# Altium schematic sheet TOP.SchDoc
size C; DocumentNumber: 1; SheetNumber: 1; SheetTotal: 13
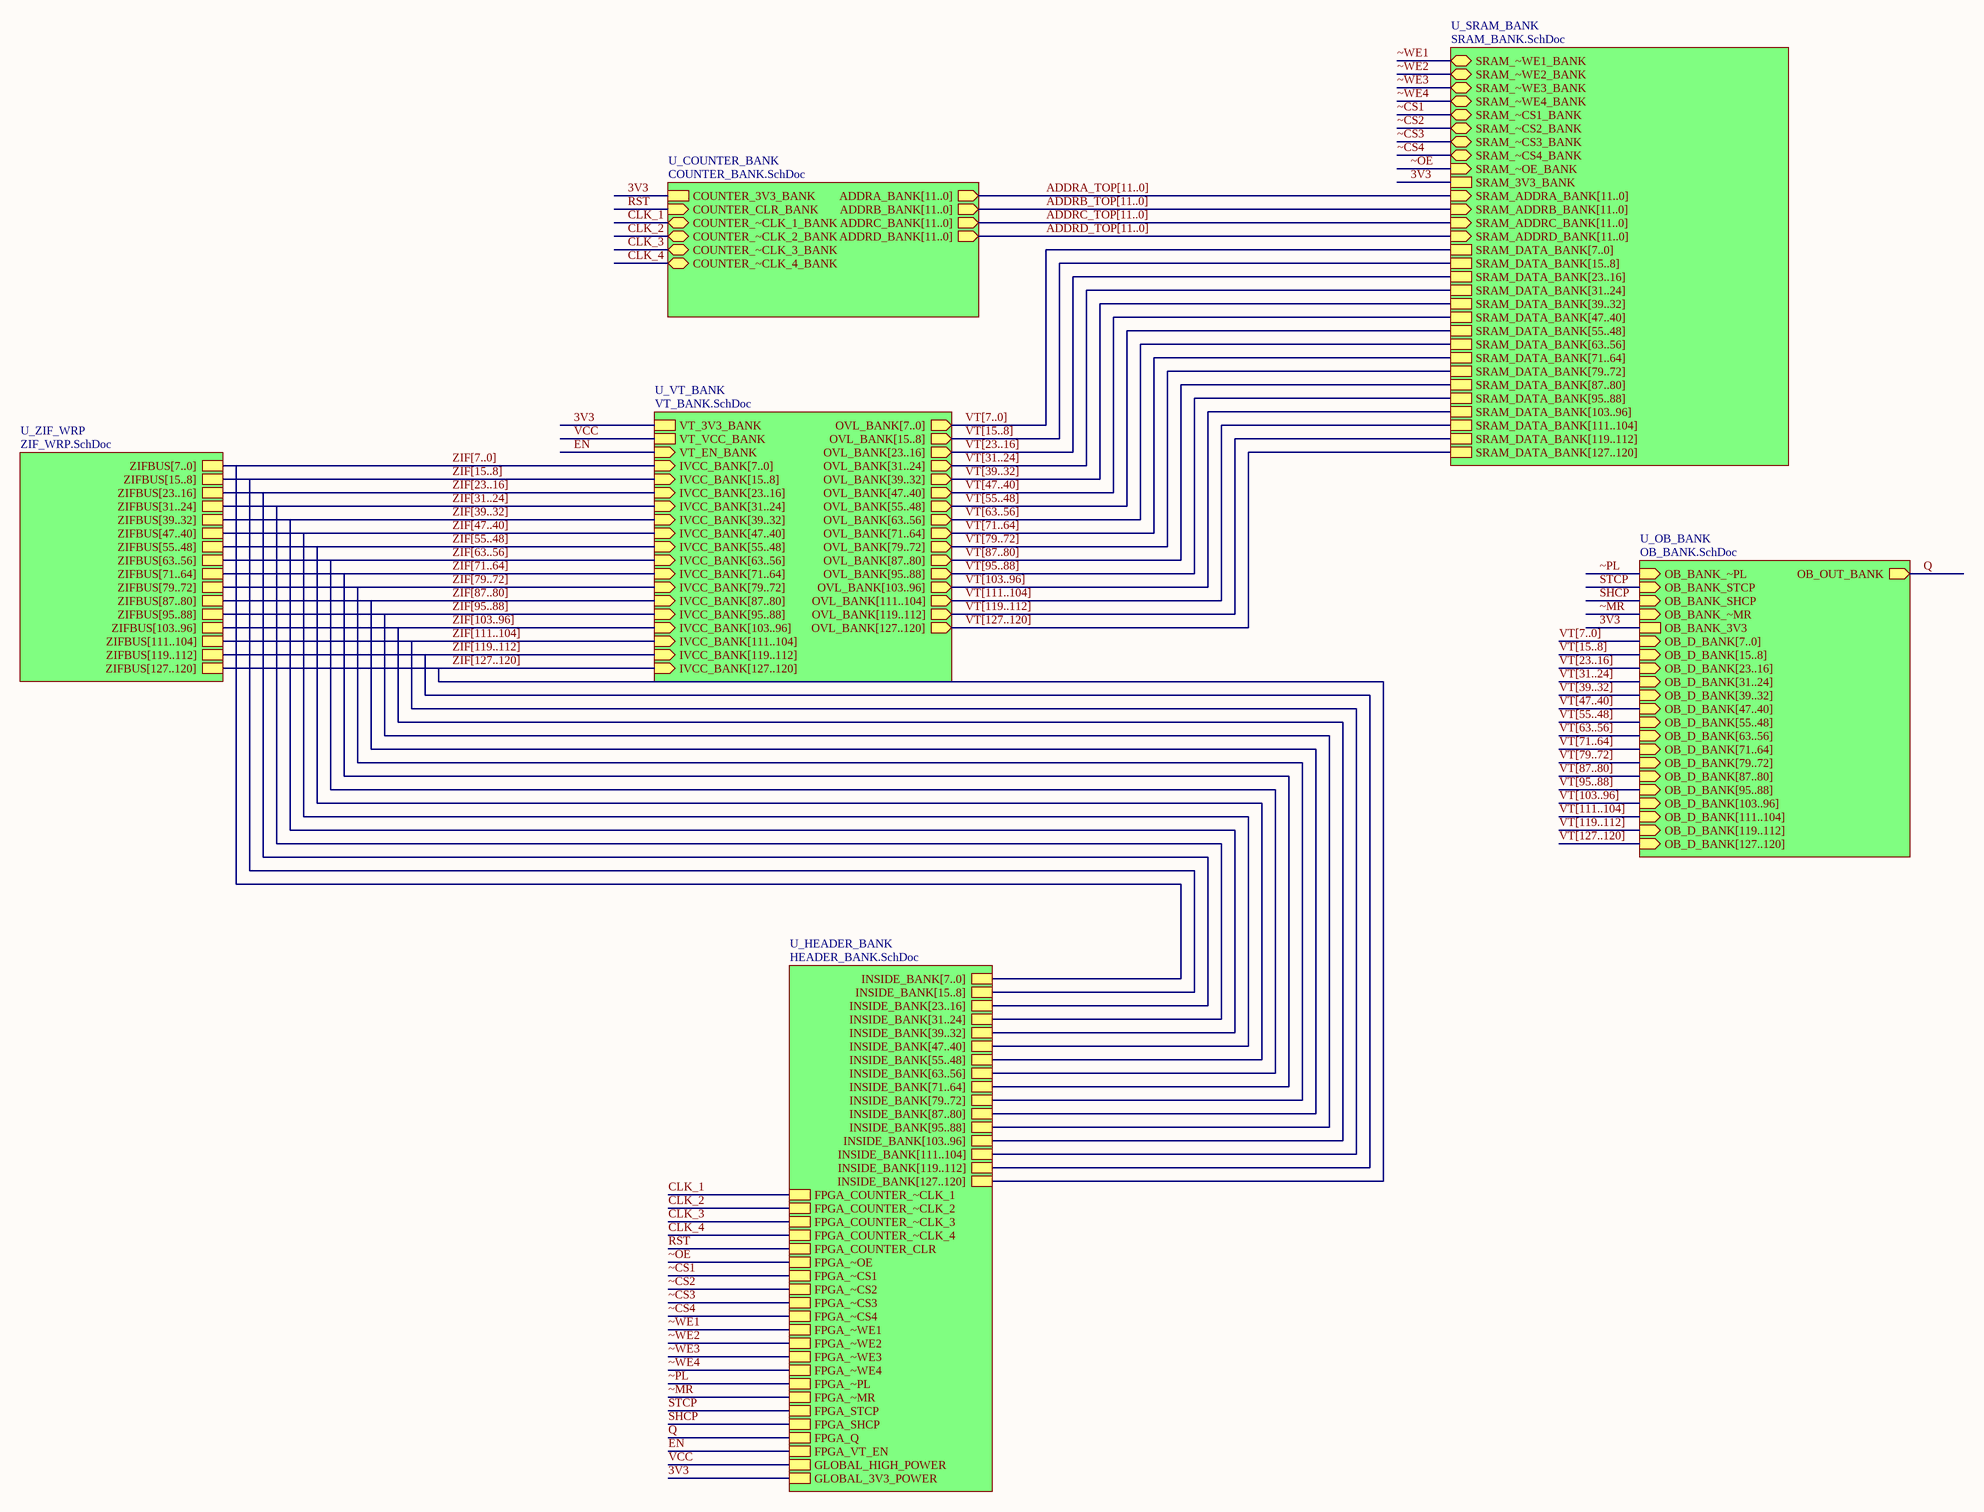
[diagram p0: TOP.SchDoc]

## Sub-sheets
U_COUNTER_BANK = COUNTER_BANK.SchDoc: ADDRA_BANK[11..0], ADDRB_BANK[11..0], ADDRC_BANK[11..0], ADDRD_BANK[11..0], COUNTER_3V3_BANK, COUNTER_CLR_BANK, COUNTER_~CLK_3_BANK, COUNTER_~CLK_2_BANK, COUNTER_~CLK_1_BANK, COUNTER_~CLK_4_BANK
U_HEADER_BANK = HEADER_BANK.SchDoc: INSIDE_BANK[7..0], INSIDE_BANK[15..8], INSIDE_BANK[23..16], INSIDE_BANK[31..24], INSIDE_BANK[39..32], INSIDE_BANK[47..40], INSIDE_BANK[55..48], INSIDE_BANK[63..56], INSIDE_BANK[71..64], INSIDE_BANK[79..72], INSIDE_BANK[87..80], INSIDE_BANK[95..88], INSIDE_BANK[103..96], INSIDE_BANK[111..104], INSIDE_BANK[119..112], INSIDE_BANK[127..120], FPGA_COUNTER_~CLK_2, FPGA_COUNTER_~CLK_3, FPGA_COUNTER_~CLK_4, FPGA_~CS1, FPGA_~OE, FPGA_~WE1, FPGA_~PL, FPGA_~MR, FPGA_STCP, FPGA_SHCP, FPGA_VT_EN, GLOBAL_HIGH_POWER, GLOBAL_3V3_POWER, FPGA_Q, FPGA_~CS2, FPGA_~WE2, FPGA_~CS3, FPGA_~WE3, FPGA_~CS4, FPGA_~WE4, FPGA_COUNTER_~CLK_1, FPGA_COUNTER_CLR
U_OB_BANK = OB_BANK.SchDoc: OB_OUT_BANK, OB_BANK_~PL, OB_BANK_STCP, OB_BANK_SHCP, OB_BANK_~MR, OB_BANK_3V3, OB_D_BANK[7..0], OB_D_BANK[15..8], OB_D_BANK[23..16], OB_D_BANK[31..24], OB_D_BANK[39..32], OB_D_BANK[47..40], OB_D_BANK[55..48], OB_D_BANK[63..56], OB_D_BANK[71..64], OB_D_BANK[79..72], OB_D_BANK[87..80], OB_D_BANK[95..88], OB_D_BANK[103..96], OB_D_BANK[111..104], OB_D_BANK[119..112], OB_D_BANK[127..120]
U_SRAM_BANK = SRAM_BANK.SchDoc: SRAM_~OE_BANK, SRAM_3V3_BANK, SRAM_ADDRA_BANK[11..0], SRAM_ADDRB_BANK[11..0], SRAM_ADDRC_BANK[11..0], SRAM_ADDRD_BANK[11..0], SRAM_DATA_BANK[7..0], SRAM_DATA_BANK[23..16], SRAM_DATA_BANK[39..32], SRAM_DATA_BANK[55..48], SRAM_DATA_BANK[71..64], SRAM_DATA_BANK[87..80], SRAM_DATA_BANK[103..96], SRAM_DATA_BANK[119..112], SRAM_DATA_BANK[15..8], SRAM_DATA_BANK[31..24], SRAM_DATA_BANK[47..40], SRAM_DATA_BANK[63..56], SRAM_DATA_BANK[79..72], SRAM_DATA_BANK[95..88], SRAM_DATA_BANK[111..104], SRAM_DATA_BANK[127..120], SRAM_~CS3_BANK, SRAM_~WE2_BANK, SRAM_~WE3_BANK, SRAM_~WE1_BANK, SRAM_~WE4_BANK, SRAM_~CS4_BANK, SRAM_~CS1_BANK, SRAM_~CS2_BANK
U_VT_BANK = VT_BANK.SchDoc: VT_3V3_BANK, VT_VCC_BANK, VT_EN_BANK, OVL_BANK[7..0], OVL_BANK[15..8], OVL_BANK[23..16], OVL_BANK[31..24], OVL_BANK[39..32], OVL_BANK[47..40], OVL_BANK[55..48], OVL_BANK[63..56], OVL_BANK[71..64], OVL_BANK[79..72], OVL_BANK[87..80], OVL_BANK[95..88], OVL_BANK[103..96], OVL_BANK[111..104], OVL_BANK[119..112], OVL_BANK[127..120], IVCC_BANK[7..0], IVCC_BANK[15..8], IVCC_BANK[23..16], IVCC_BANK[31..24], IVCC_BANK[39..32], IVCC_BANK[47..40], IVCC_BANK[55..48], IVCC_BANK[63..56], IVCC_BANK[71..64], IVCC_BANK[79..72], IVCC_BANK[87..80], IVCC_BANK[95..88], IVCC_BANK[103..96], IVCC_BANK[111..104], IVCC_BANK[119..112], IVCC_BANK[127..120]
U_ZIF_WRP = ZIF_WRP.SchDoc: ZIFBUS[7..0], ZIFBUS[15..8], ZIFBUS[23..16], ZIFBUS[31..24], ZIFBUS[71..64], ZIFBUS[79..72], ZIFBUS[87..80], ZIFBUS[95..88], ZIFBUS[103..96], ZIFBUS[111..104], ZIFBUS[119..112], ZIFBUS[127..120], ZIFBUS[39..32], ZIFBUS[47..40], ZIFBUS[55..48], ZIFBUS[63..56]

## Nets
3V3: sheet U_COUNTER_BANK/COUNTER_3V3_BANK, sheet U_VT_BANK/VT_3V3_BANK, sheet U_OB_BANK/OB_BANK_3V3, sheet U_SRAM_BANK/SRAM_3V3_BANK, sheet U_HEADER_BANK/GLOBAL_3V3_POWER
CLK_1: sheet U_COUNTER_BANK/COUNTER_~CLK_1_BANK, sheet U_HEADER_BANK/FPGA_COUNTER_~CLK_1
CLK_2: sheet U_COUNTER_BANK/COUNTER_~CLK_2_BANK, sheet U_HEADER_BANK/FPGA_COUNTER_~CLK_2
CLK_3: sheet U_COUNTER_BANK/COUNTER_~CLK_3_BANK, sheet U_HEADER_BANK/FPGA_COUNTER_~CLK_3
CLK_4: sheet U_COUNTER_BANK/COUNTER_~CLK_4_BANK, sheet U_HEADER_BANK/FPGA_COUNTER_~CLK_4
EN: sheet U_VT_BANK/VT_EN_BANK, sheet U_HEADER_BANK/FPGA_VT_EN
Q: sheet U_OB_BANK/OB_OUT_BANK, sheet U_HEADER_BANK/FPGA_Q
RST: sheet U_COUNTER_BANK/COUNTER_CLR_BANK, sheet U_HEADER_BANK/FPGA_COUNTER_CLR
SHCP: sheet U_OB_BANK/OB_BANK_SHCP, sheet U_HEADER_BANK/FPGA_SHCP
STCP: sheet U_OB_BANK/OB_BANK_STCP, sheet U_HEADER_BANK/FPGA_STCP
VCC: sheet U_VT_BANK/VT_VCC_BANK, sheet U_HEADER_BANK/GLOBAL_HIGH_POWER
~CS1: sheet U_SRAM_BANK/SRAM_~CS1_BANK, sheet U_HEADER_BANK/FPGA_~CS1
~CS2: sheet U_SRAM_BANK/SRAM_~CS2_BANK, sheet U_HEADER_BANK/FPGA_~CS2
~CS3: sheet U_SRAM_BANK/SRAM_~CS3_BANK, sheet U_HEADER_BANK/FPGA_~CS3
~CS4: sheet U_SRAM_BANK/SRAM_~CS4_BANK, sheet U_HEADER_BANK/FPGA_~CS4
~MR: sheet U_OB_BANK/OB_BANK_~MR, sheet U_HEADER_BANK/FPGA_~MR
~OE: sheet U_SRAM_BANK/SRAM_~OE_BANK, sheet U_HEADER_BANK/FPGA_~OE
~PL: sheet U_OB_BANK/OB_BANK_~PL, sheet U_HEADER_BANK/FPGA_~PL
~WE1: sheet U_SRAM_BANK/SRAM_~WE1_BANK, sheet U_HEADER_BANK/FPGA_~WE1
~WE2: sheet U_SRAM_BANK/SRAM_~WE2_BANK, sheet U_HEADER_BANK/FPGA_~WE2
~WE3: sheet U_SRAM_BANK/SRAM_~WE3_BANK, sheet U_HEADER_BANK/FPGA_~WE3
~WE4: sheet U_SRAM_BANK/SRAM_~WE4_BANK, sheet U_HEADER_BANK/FPGA_~WE4

## Buses and harness runs
bus ADDRA_TOP[11..0] = sheet U_COUNTER_BANK/ADDRA_BANK[11..0] = sheet U_SRAM_BANK/SRAM_ADDRA_BANK[11..0]
bus ADDRB_TOP[11..0] = sheet U_COUNTER_BANK/ADDRB_BANK[11..0] = sheet U_SRAM_BANK/SRAM_ADDRB_BANK[11..0]
bus ADDRC_TOP[11..0] = sheet U_COUNTER_BANK/ADDRC_BANK[11..0] = sheet U_SRAM_BANK/SRAM_ADDRC_BANK[11..0]
bus ADDRD_TOP[11..0] = sheet U_COUNTER_BANK/ADDRD_BANK[11..0] = sheet U_SRAM_BANK/SRAM_ADDRD_BANK[11..0]
bus VT[7..0] = sheet U_OB_BANK/OB_D_BANK[7..0]
bus VT[7..0] = sheet U_SRAM_BANK/SRAM_DATA_BANK[7..0] = sheet U_VT_BANK/OVL_BANK[7..0]
bus VT[15..8] = sheet U_OB_BANK/OB_D_BANK[15..8]
bus VT[15..8] = sheet U_SRAM_BANK/SRAM_DATA_BANK[15..8] = sheet U_VT_BANK/OVL_BANK[15..8]
bus VT[23..16] = sheet U_OB_BANK/OB_D_BANK[23..16]
bus VT[23..16] = sheet U_SRAM_BANK/SRAM_DATA_BANK[23..16] = sheet U_VT_BANK/OVL_BANK[23..16]
bus VT[31..24] = sheet U_OB_BANK/OB_D_BANK[31..24]
bus VT[31..24] = sheet U_SRAM_BANK/SRAM_DATA_BANK[31..24] = sheet U_VT_BANK/OVL_BANK[31..24]
bus VT[39..32] = sheet U_OB_BANK/OB_D_BANK[39..32]
bus VT[39..32] = sheet U_SRAM_BANK/SRAM_DATA_BANK[39..32] = sheet U_VT_BANK/OVL_BANK[39..32]
bus VT[47..40] = sheet U_OB_BANK/OB_D_BANK[47..40]
bus VT[47..40] = sheet U_SRAM_BANK/SRAM_DATA_BANK[47..40] = sheet U_VT_BANK/OVL_BANK[47..40]
bus VT[55..48] = sheet U_OB_BANK/OB_D_BANK[55..48]
bus VT[55..48] = sheet U_SRAM_BANK/SRAM_DATA_BANK[55..48] = sheet U_VT_BANK/OVL_BANK[55..48]
bus VT[63..56] = sheet U_OB_BANK/OB_D_BANK[63..56]
bus VT[63..56] = sheet U_SRAM_BANK/SRAM_DATA_BANK[63..56] = sheet U_VT_BANK/OVL_BANK[63..56]
bus VT[71..64] = sheet U_OB_BANK/OB_D_BANK[71..64]
bus VT[71..64] = sheet U_SRAM_BANK/SRAM_DATA_BANK[71..64] = sheet U_VT_BANK/OVL_BANK[71..64]
bus VT[79..72] = sheet U_OB_BANK/OB_D_BANK[79..72]
bus VT[79..72] = sheet U_SRAM_BANK/SRAM_DATA_BANK[79..72] = sheet U_VT_BANK/OVL_BANK[79..72]
bus VT[87..80] = sheet U_OB_BANK/OB_D_BANK[87..80]
bus VT[87..80] = sheet U_SRAM_BANK/SRAM_DATA_BANK[87..80] = sheet U_VT_BANK/OVL_BANK[87..80]
bus VT[95..88] = sheet U_OB_BANK/OB_D_BANK[95..88]
bus VT[95..88] = sheet U_SRAM_BANK/SRAM_DATA_BANK[95..88] = sheet U_VT_BANK/OVL_BANK[95..88]
bus VT[103..96] = sheet U_OB_BANK/OB_D_BANK[103..96]
bus VT[103..96] = sheet U_SRAM_BANK/SRAM_DATA_BANK[103..96] = sheet U_VT_BANK/OVL_BANK[103..96]
bus VT[111..104] = sheet U_OB_BANK/OB_D_BANK[111..104]
bus VT[111..104] = sheet U_SRAM_BANK/SRAM_DATA_BANK[111..104] = sheet U_VT_BANK/OVL_BANK[111..104]
bus VT[119..112] = sheet U_OB_BANK/OB_D_BANK[119..112]
bus VT[119..112] = sheet U_SRAM_BANK/SRAM_DATA_BANK[119..112] = sheet U_VT_BANK/OVL_BANK[119..112]
bus VT[127..120] = sheet U_OB_BANK/OB_D_BANK[127..120]
bus VT[127..120] = sheet U_SRAM_BANK/SRAM_DATA_BANK[127..120] = sheet U_VT_BANK/OVL_BANK[127..120]
bus ZIF[7..0] = sheet U_HEADER_BANK/INSIDE_BANK[7..0] = sheet U_VT_BANK/IVCC_BANK[7..0] = sheet U_ZIF_WRP/ZIFBUS[7..0]
bus ZIF[15..8] = sheet U_HEADER_BANK/INSIDE_BANK[15..8] = sheet U_VT_BANK/IVCC_BANK[15..8] = sheet U_ZIF_WRP/ZIFBUS[15..8]
bus ZIF[23..16] = sheet U_HEADER_BANK/INSIDE_BANK[23..16] = sheet U_VT_BANK/IVCC_BANK[23..16] = sheet U_ZIF_WRP/ZIFBUS[23..16]
bus ZIF[31..24] = sheet U_HEADER_BANK/INSIDE_BANK[31..24] = sheet U_VT_BANK/IVCC_BANK[31..24] = sheet U_ZIF_WRP/ZIFBUS[31..24]
bus ZIF[39..32] = sheet U_HEADER_BANK/INSIDE_BANK[39..32] = sheet U_VT_BANK/IVCC_BANK[39..32] = sheet U_ZIF_WRP/ZIFBUS[39..32]
bus ZIF[47..40] = sheet U_HEADER_BANK/INSIDE_BANK[47..40] = sheet U_VT_BANK/IVCC_BANK[47..40] = sheet U_ZIF_WRP/ZIFBUS[47..40]
bus ZIF[55..48] = sheet U_HEADER_BANK/INSIDE_BANK[55..48] = sheet U_VT_BANK/IVCC_BANK[55..48] = sheet U_ZIF_WRP/ZIFBUS[55..48]
bus ZIF[63..56] = sheet U_HEADER_BANK/INSIDE_BANK[63..56] = sheet U_VT_BANK/IVCC_BANK[63..56] = sheet U_ZIF_WRP/ZIFBUS[63..56]
bus ZIF[71..64] = sheet U_HEADER_BANK/INSIDE_BANK[71..64] = sheet U_VT_BANK/IVCC_BANK[71..64] = sheet U_ZIF_WRP/ZIFBUS[71..64]
bus ZIF[79..72] = sheet U_HEADER_BANK/INSIDE_BANK[79..72] = sheet U_VT_BANK/IVCC_BANK[79..72] = sheet U_ZIF_WRP/ZIFBUS[79..72]
bus ZIF[87..80] = sheet U_HEADER_BANK/INSIDE_BANK[87..80] = sheet U_VT_BANK/IVCC_BANK[87..80] = sheet U_ZIF_WRP/ZIFBUS[87..80]
bus ZIF[95..88] = sheet U_HEADER_BANK/INSIDE_BANK[95..88] = sheet U_VT_BANK/IVCC_BANK[95..88] = sheet U_ZIF_WRP/ZIFBUS[95..88]
bus ZIF[103..96] = sheet U_HEADER_BANK/INSIDE_BANK[103..96] = sheet U_VT_BANK/IVCC_BANK[103..96] = sheet U_ZIF_WRP/ZIFBUS[103..96]
bus ZIF[111..104] = sheet U_HEADER_BANK/INSIDE_BANK[111..104] = sheet U_VT_BANK/IVCC_BANK[111..104] = sheet U_ZIF_WRP/ZIFBUS[111..104]
bus ZIF[119..112] = sheet U_HEADER_BANK/INSIDE_BANK[119..112] = sheet U_VT_BANK/IVCC_BANK[119..112] = sheet U_ZIF_WRP/ZIFBUS[119..112]
bus ZIF[127..120] = sheet U_HEADER_BANK/INSIDE_BANK[127..120] = sheet U_VT_BANK/IVCC_BANK[127..120] = sheet U_ZIF_WRP/ZIFBUS[127..120]